# Altium schematic sheet [01] MCU.SchDoc
size A3
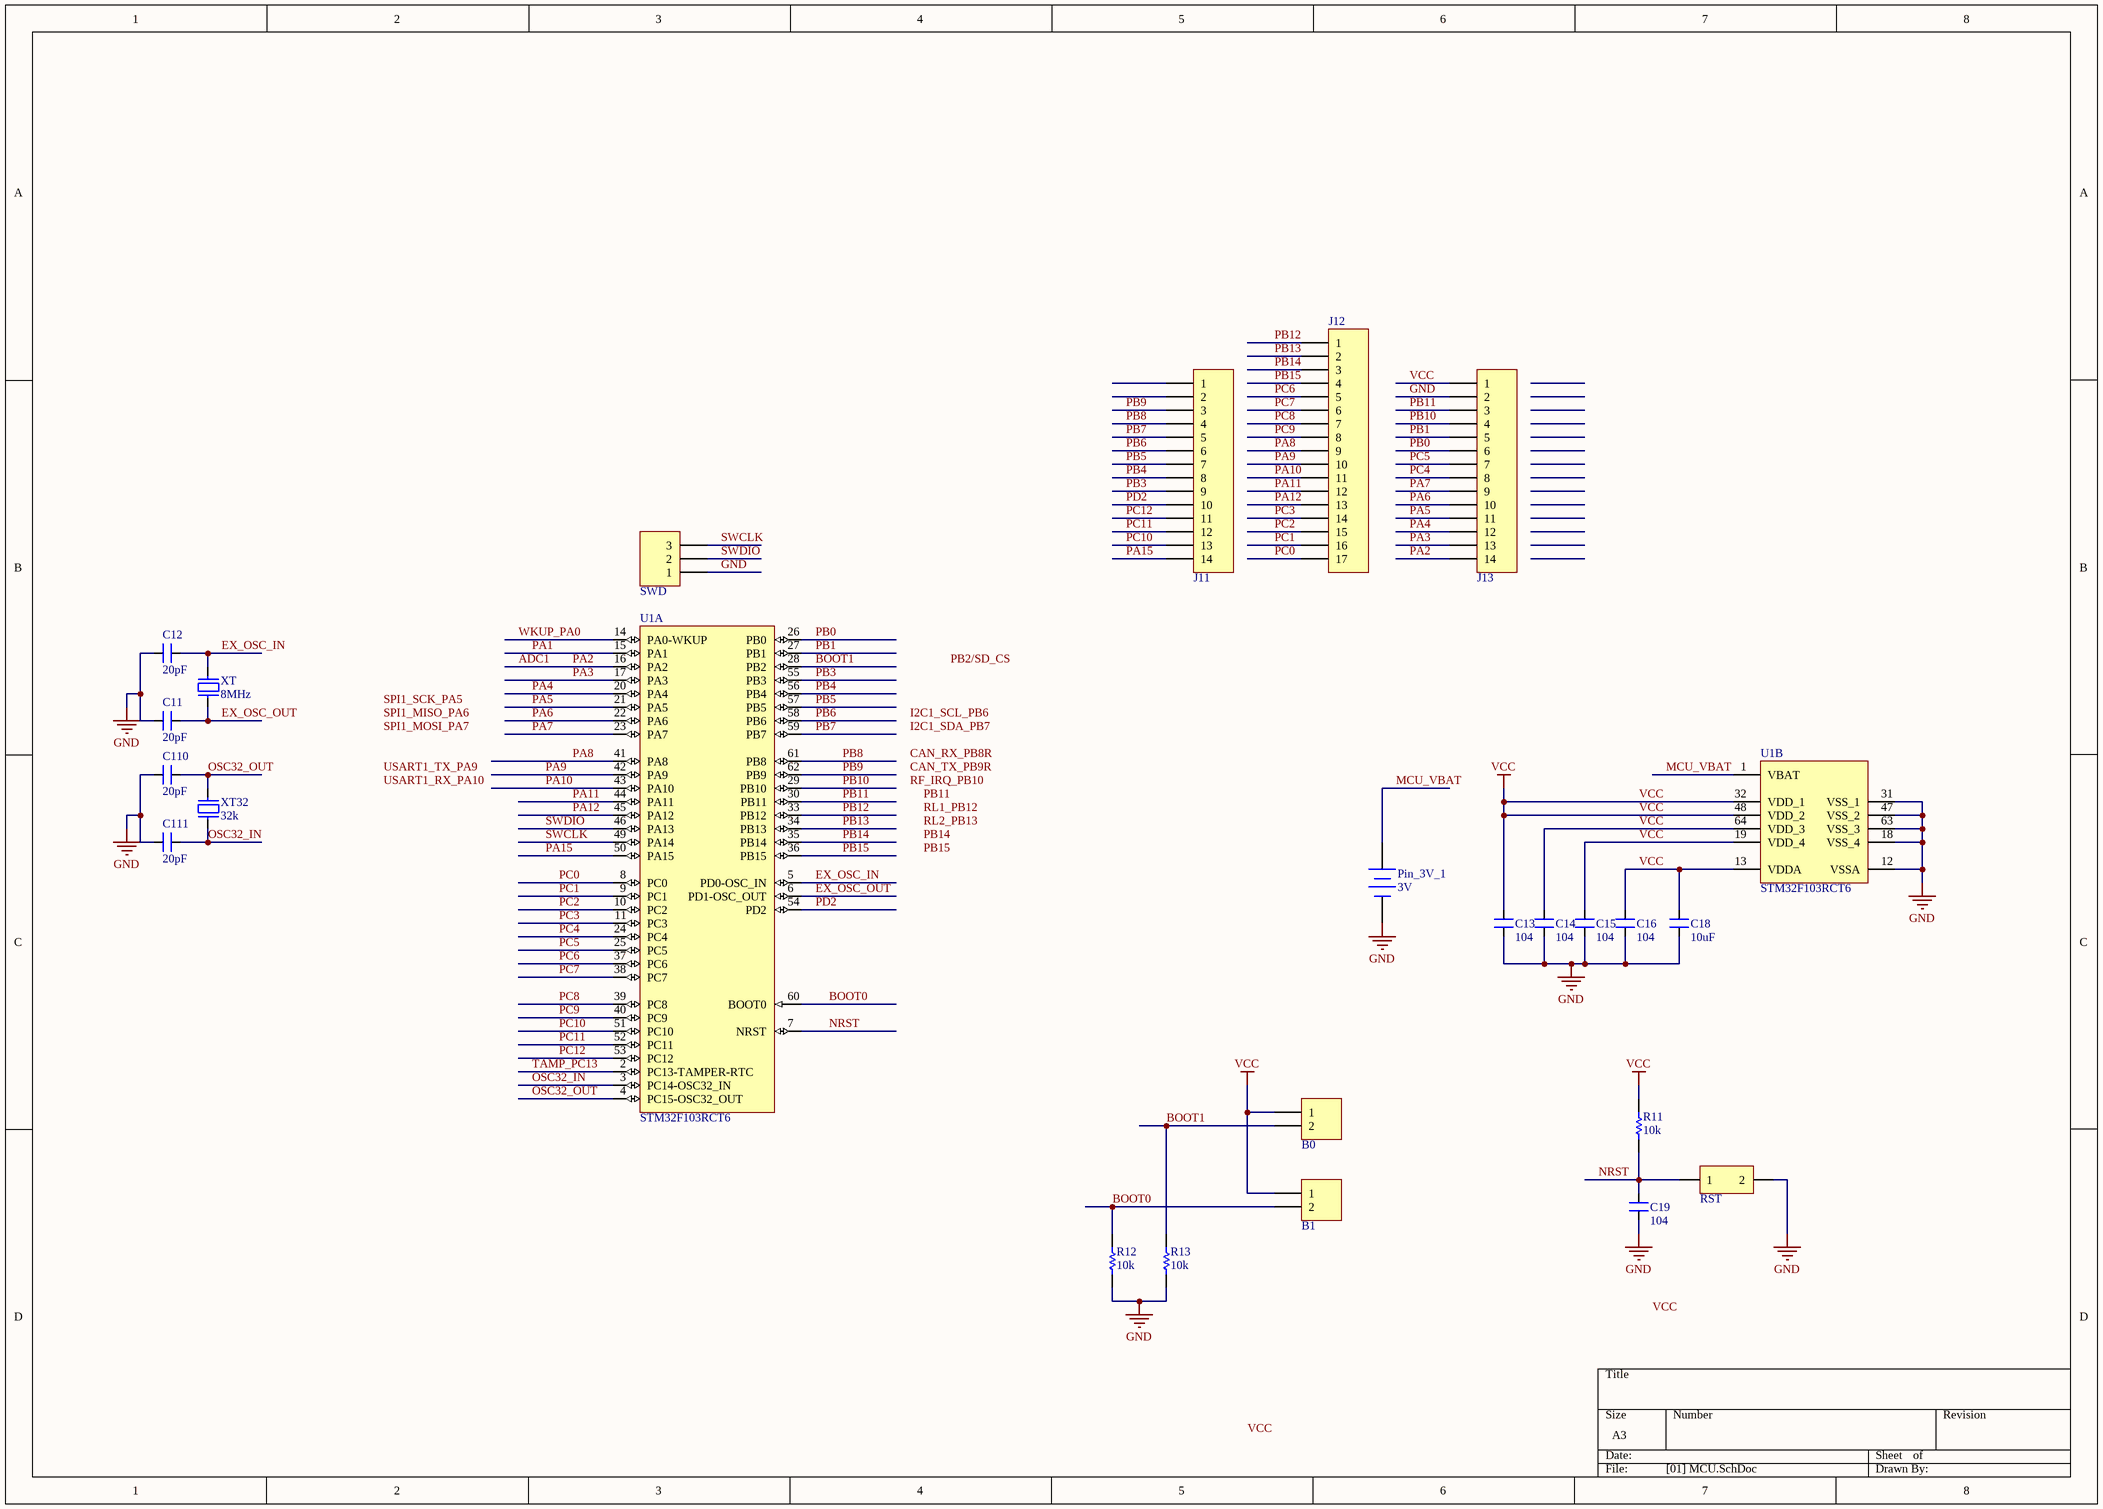
[diagram p0: [01] MCU.SchDoc]

## Parts
B0  Header 2  [HDR1X2]  (value not drawn)
B1  Header 2  [HDR1X2]  (value not drawn)
C11  value 20pF  [CAPC1608N]  (hidden comment: Cap_22p_0603)
C12  value 20pF  [CAPC1608N]  (hidden comment: Cap_22p_0603)
C13  value 104  [CAPC1608N]  (hidden comment: Cap_104_0603)
C14  value 104  [CAPC1608N]  (hidden comment: Cap_104_0603)
C15  value 104  [CAPC1608N]  (hidden comment: Cap_104_0603)
C16  value 104  [CAPC1608N]  (hidden comment: Cap_104_0603)
C18  value 10uF  [CAPC2012N_F]  (hidden comment: Cap_10uF_0805)
C19  value 104  [CAPC1608N]  (hidden comment: Cap_104_0603)
C110  value 20pF  [CAPC1608N]  (hidden comment: Cap_22p_0603)
C111  value 20pF  [CAPC1608N]  (hidden comment: Cap_22p_0603)
J11  Header 14  [HDR1X14]  (value not drawn)
J12  Header 17  [HDR1X17]  (value not drawn)
J13  Header 14  [HDR1X14]  (value not drawn)
Pin_3V_1  3V  [CR1220]
R11  value 10k  [RESC1608N_F]  (hidden comment: Res_10k_0603)
R12  value 10k  [RESC1608N_F]  (hidden comment: Res_10k_0603)
R13  value 10k  [RESC1608N_F]  (hidden comment: Res_10k_0603)
RST  Button  [SW]  (value not drawn)
SWD  Header 3  [HDR1X3]  (value not drawn)
U1  STM32F103RCT6  [STM-LQFP64_N]  (parts A,B of 2)
XT  8MHz  [XT2]
XT32  32k  [XTminiv2]

## Nets
GND: C11.2 C12.2 C13.1 C14.1 C15.1 C16.1 C18.1 C19.1 C110.2 C111.2 J13.2 Pin_3V_1.2(-) R12.1 R13.1 RST.2 SWD.1 U1.12(VSSA) U1.18(VSS_4) U1.31(VSS_1) U1.47(VSS_2) U1.63(VSS_3)
VCC: B0.1 B1.1 C13.2 C14.2 C15.2 C16.2 C18.2 J13.1 R11.2 U1.13(VDDA) U1.19(VDD_4) U1.32(VDD_1) U1.48(VDD_2) U1.64(VDD_3)
ADC1: J13.14 U1.16(PA2)  [also labelled PA2]
BOOT0: B1.2 R12.2 U1.60(BOOT0)
BOOT1: B0.2 R13.2 U1.28(PB2)
EX_OSC_IN: C12.1 U1.5(PD0-OSC_IN) XT.2
EX_OSC_OUT: C11.1 U1.6(PD1-OSC_OUT) XT.1
MCU_VBAT: Pin_3V_1.1(+) U1.1(VBAT)
NRST: C19.2 R11.1 RST.1 U1.7(NRST)
OSC32_IN: C111.1 U1.3(PC14-OSC32_IN) XT32.1
OSC32_OUT: C110.1 U1.4(PC15-OSC32_OUT) XT32.2
PA1: U1.15(PA1)
PA3: J13.13 U1.17(PA3)
PA4: J13.12 U1.20(PA4)
PA5: J13.11 U1.21(PA5)
PA6: J13.10 U1.22(PA6)
PA7: J13.9 U1.23(PA7)
PA8: J12.9 U1.41(PA8)
PA9: J12.10 U1.42(PA9)
PA10: J12.11 U1.43(PA10)
PA11: J12.12 U1.44(PA11)
PA12: J12.13 U1.45(PA12)
PA15: J11.14 U1.50(PA15)
PB0: J13.6 U1.26(PB0)
PB1: J13.5 U1.27(PB1)
PB3: J11.9 U1.55(PB3)
PB4: J11.8 U1.56(PB4)
PB5: J11.7 U1.57(PB5)
PB6: J11.6 U1.58(PB6)
PB7: J11.5 U1.59(PB7)
PB8: J11.4 U1.61(PB8)
PB9: J11.3 U1.62(PB9)
PB10: J13.4 U1.29(PB10)
PB11: J13.3 U1.30(PB11)
PB12: J12.1 U1.33(PB12)
PB13: J12.2 U1.34(PB13)
PB14: J12.3 U1.35(PB14)
PB15: J12.4 U1.36(PB15)
PC0: J12.17 U1.8(PC0)
PC1: J12.16 U1.9(PC1)
PC2: J12.15 U1.10(PC2)
PC3: J12.14 U1.11(PC3)
PC4: J13.8 U1.24(PC4)
PC5: J13.7 U1.25(PC5)
PC6: J12.5 U1.37(PC6)
PC7: J12.6 U1.38(PC7)
PC8: J12.7 U1.39(PC8)
PC9: J12.8 U1.40(PC9)
PC10: J11.13 U1.51(PC10)
PC11: J11.12 U1.52(PC11)
PC12: J11.11 U1.53(PC12)
PD2: J11.10 U1.54(PD2)
SWCLK: SWD.3 U1.49(PA14)
SWDIO: SWD.2 U1.46(PA13)
TAMP_PC13: U1.2(PC13-TAMPER-RTC)
WKUP_PA0: U1.14(PA0-WKUP)

Not connected (* = marked no-connect by the designer): J11 1 2

## Notes on the sheet
- Labels drawn without touching a wire or pin: CAN_RX_PB8R, CAN_TX_PB9R, I2C1_SCL_PB6, I2C1_SDA_PB7, PB2/SD_CS, PB11, PB14, PB15, RF_IRQ_PB10, RL1_PB12, RL2_PB13, SPI1_MISO_PA6, SPI1_MOSI_PA7, SPI1_SCK_PA5, USART1_RX_PA10, USART1_TX_PA9, VCC

## Library data of the parts
B0 B1 = Header 2: Header, 2-Pin; LatestRevisionDate: 17-Jul-2002; LatestRevisionNote: Re-released for DXP Platform.; Publisher: Altium Limited
C11-C16 C18 C19 C110 C111 = CAP NP
J11 J13 = Header 14: Header, 14-Pin; LatestRevisionDate: 17-Jul-2002; LatestRevisionNote: Re-released for DXP Platform.; Publisher: Altium Limited
J12 = Header 17: Header, 17-Pin; LatestRevisionDate: 17-Jul-2002; LatestRevisionNote: Re-released for DXP Platform.; Publisher: Altium Limited
Pin_3V_1 = Battery: Multicell Battery; Published: 24-Mar-1999; LatestRevisionDate: 17-Jul-2002; LatestRevisionNote: Re-released for DXP Platform.; PackageReference: BAT-2; Publisher: Altium Limited
R11-R13 = Res
RST = Button I
SWD = Header 3: Header, 3-Pin; LatestRevisionDate: 17-Jul-2002; LatestRevisionNote: Re-released for DXP Platform.; Publisher: Altium Limited
U1 = STM32F103RCT6: ARM Cortex-M3 32-bit MCU, 256 KB Flash, 48 KB Internal RAM, 51 I/Os, 64-pin LQFP, -40 to 85 degC, Tray; A/D Converter: 3x12-bit (16 Channel); D/A Converter: 2x12-bit (2 Channel); FLASH Size (Prog) (kB): 256; I/Os (High Current): 51; Internal RAM Size (kB): 48; Operating Frequency(F) (Processor speed) (MHz): 72; Supply Voltage(Vcc) min (V): 2; DatasheetVersion: Rev. 8; PackageVersion: Rev. 4, 06/2013; PackageReference: LQFP64; PackageDescription: 64-Pin Low Profile Quad Flat Package, 10 x 10 mm Body, 0.5 mm Pitch; Supplier 1: Digi-Key; Supplier Part Number 1: 497-9033-ND; Supplier 2: Newark; Supplier Part Number 2: 01P4099; Supplier 3: Newark; Supplier Part Number 3: 57P1227; Supplier 4: Mouser; Supplier Part Number 4: 511-STM32F103RCT6; Core: ARM Cortex-M3; Packing: Tray; Mounting Technology: Surface Mount; PartNumber: STM32F103RCT6; ComponentLink1Description: Manufacturer URL; ComponentLink1URL: http://www.st.com/web/en/home.html; ComponentLink2Description: Datasheet; ComponentLink2URL: http://www.st.com/st-web-ui/static/active/en/resource/technical/document/datasheet/CD00191185.pdf; ComponentLink3Description: Package Specification; ComponentLink3URL: http://www.st.com/st-web-ui/static/active/en/resource/technical/document/datasheet/DM00037051.pdf
XT XT32 = Crystal